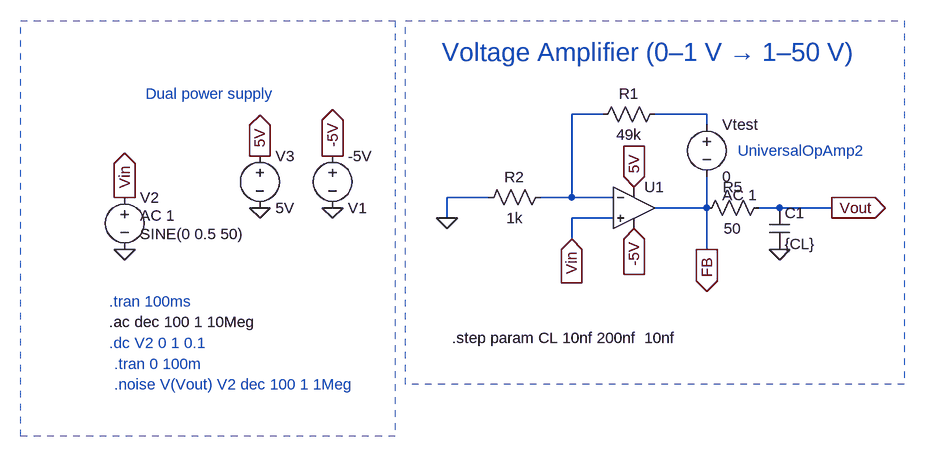
[diagram p0: schematic Voltage Amplifier with UniversalOpAmp2.asc]
Voltage Amplifier with UniversalOpAmp2.asc, the LTspice schematic file:
Version 4
SHEET 1 1872 680
WIRE -96 -48 -144 -48
WIRE 64 -48 -16 -48
WIRE 64 -32 64 -48
WIRE -272 80 -336 80
WIRE -144 80 -144 -48
WIRE -144 80 -192 80
WIRE -80 80 -144 80
WIRE 64 96 64 48
WIRE 64 96 -16 96
WIRE 176 96 144 96
WIRE 256 96 176 96
WIRE -336 112 -336 80
WIRE -80 112 -144 112
WIRE -144 144 -144 112
WIRE 64 160 64 96
FLAG -336 112 0
FLAG -512 96 0
FLAG -624 96 0
FLAG -48 128 -5V
IOPIN -48 128 In
FLAG -624 16 5V
IOPIN -624 16 Out
FLAG -512 16 -5V
IOPIN -512 16 Out
FLAG -48 64 5V
IOPIN -48 64 In
FLAG -832 160 0
FLAG -832 80 Vin
IOPIN -832 80 Out
FLAG -144 144 Vin
IOPIN -144 144 In
FLAG 176 160 0
FLAG 256 96 Vout
IOPIN 256 96 Out
FLAG 64 160 FB
IOPIN 64 160 Out
SYMBOL OpAmps\\UniversalOpAmp -48 96 R0
SYMATTR InstName U1
SYMBOL res 0 -64 R90
WINDOW 0 0 56 VBottom 2
WINDOW 3 32 56 VTop 2
SYMATTR InstName R1
SYMATTR Value 49k
SYMBOL res -176 64 R90
WINDOW 0 0 56 VBottom 2
WINDOW 3 32 56 VTop 2
SYMATTR InstName R2
SYMATTR Value 1k
SYMBOL voltage -624 0 R0
WINDOW 123 0 0 Left 0
WINDOW 39 0 0 Left 0
SYMATTR InstName V3
SYMATTR Value 5V
SYMBOL voltage -512 0 R0
WINDOW 0 24 96 Left 2
WINDOW 3 24 16 Left 2
WINDOW 123 0 0 Left 0
WINDOW 39 0 0 Left 0
SYMATTR InstName V1
SYMATTR Value -5V
SYMBOL voltage -832 64 R0
WINDOW 123 24 44 Left 2
WINDOW 39 0 0 Left 0
WINDOW 3 24 72 Left 2
SYMATTR Value2 AC 1
SYMATTR Value SINE(0 0.5 50)
SYMATTR InstName V2
SYMBOL cap 160 96 R0
SYMATTR InstName C1
SYMATTR Value {CL}
SYMBOL res 160 80 R90
WINDOW 0 0 56 VBottom 2
WINDOW 3 32 56 VTop 2
SYMATTR InstName R5
SYMATTR Value 50
SYMBOL voltage 64 -48 R0
WINDOW 123 24 124 Left 2
WINDOW 39 0 0 Left 0
SYMATTR Value2 AC 1
SYMATTR InstName Vtest
SYMATTR Value 0
TEXT -856 240 Left 2 ;.tran 100ms
TEXT -328 296 Left 2 !.step param CL 10nf 200nf  10nf
TEXT -856 272 Left 2 !.ac dec 100 1 10Meg
TEXT -800 -80 Left 2 ;Dual power supply
TEXT 112 8 Left 2 ;UniversalOpAmp2
TEXT -856 304 Left 2 ;.dc V2 0 1 0.1
TEXT -344 -144 Left 4 ;Voltage Amplifier (0–1 V → 1–50 V)
TEXT -848 336 Left 2 ;.tran 0 100m
TEXT -848 368 Left 2 ;.noise V(Vout) V2 dec 100 1 1Meg
RECTANGLE Normal 368 368 -400 -192 2
RECTANGLE Normal -416 448 -992 -192 2

The netlist it stands for:
* Voltage Amplifier with UniversalOpAmp2.asc
XU1 Vin N001 5V -5V FB level1 Avol=1Meg GBW=10Meg Vos=0 En=0 Enk=0 In=0 Ink=0 Rin=500Meg  ; pins In+ In- V+ V- OUT
R1 N002 N001 49k
R2 N001 0 1k
V3 5V 0 5V
V1 -5V 0 -5V
V2 Vin 0 SINE(0 0.5 50) AC 1
C1 Vout 0 {CL}
R5 Vout FB 50
Vtest N002 FB 0 AC 1
* .tran 100ms
.step param CL 10nf 200nf  10nf
.ac dec 100 1 10Meg
* Dual power supply
* UniversalOpAmp2
* .dc V2 0 1 0.1
* Voltage Amplifier (0–1 V → 1–50 V)
* .tran 0 100m
* .noise V(Vout) V2 dec 100 1 1Meg
.lib UniversalOpAmp1.lib
.backanno
.end